# Altium schematic sheet CHM_CPU_FPGA_Main.SchDoc: CHOMIK CTRL module
size A3; Author: Andrzej Cichocki; Organization: Space Research Centre; Address1: Bartycka 18a; Address2: 00-716 Warsaw; Address3: Poland; Revision: 1; ModuleName: FPGA IP-Core Main; SubOrganization1: FPGA Space Applications Lab.
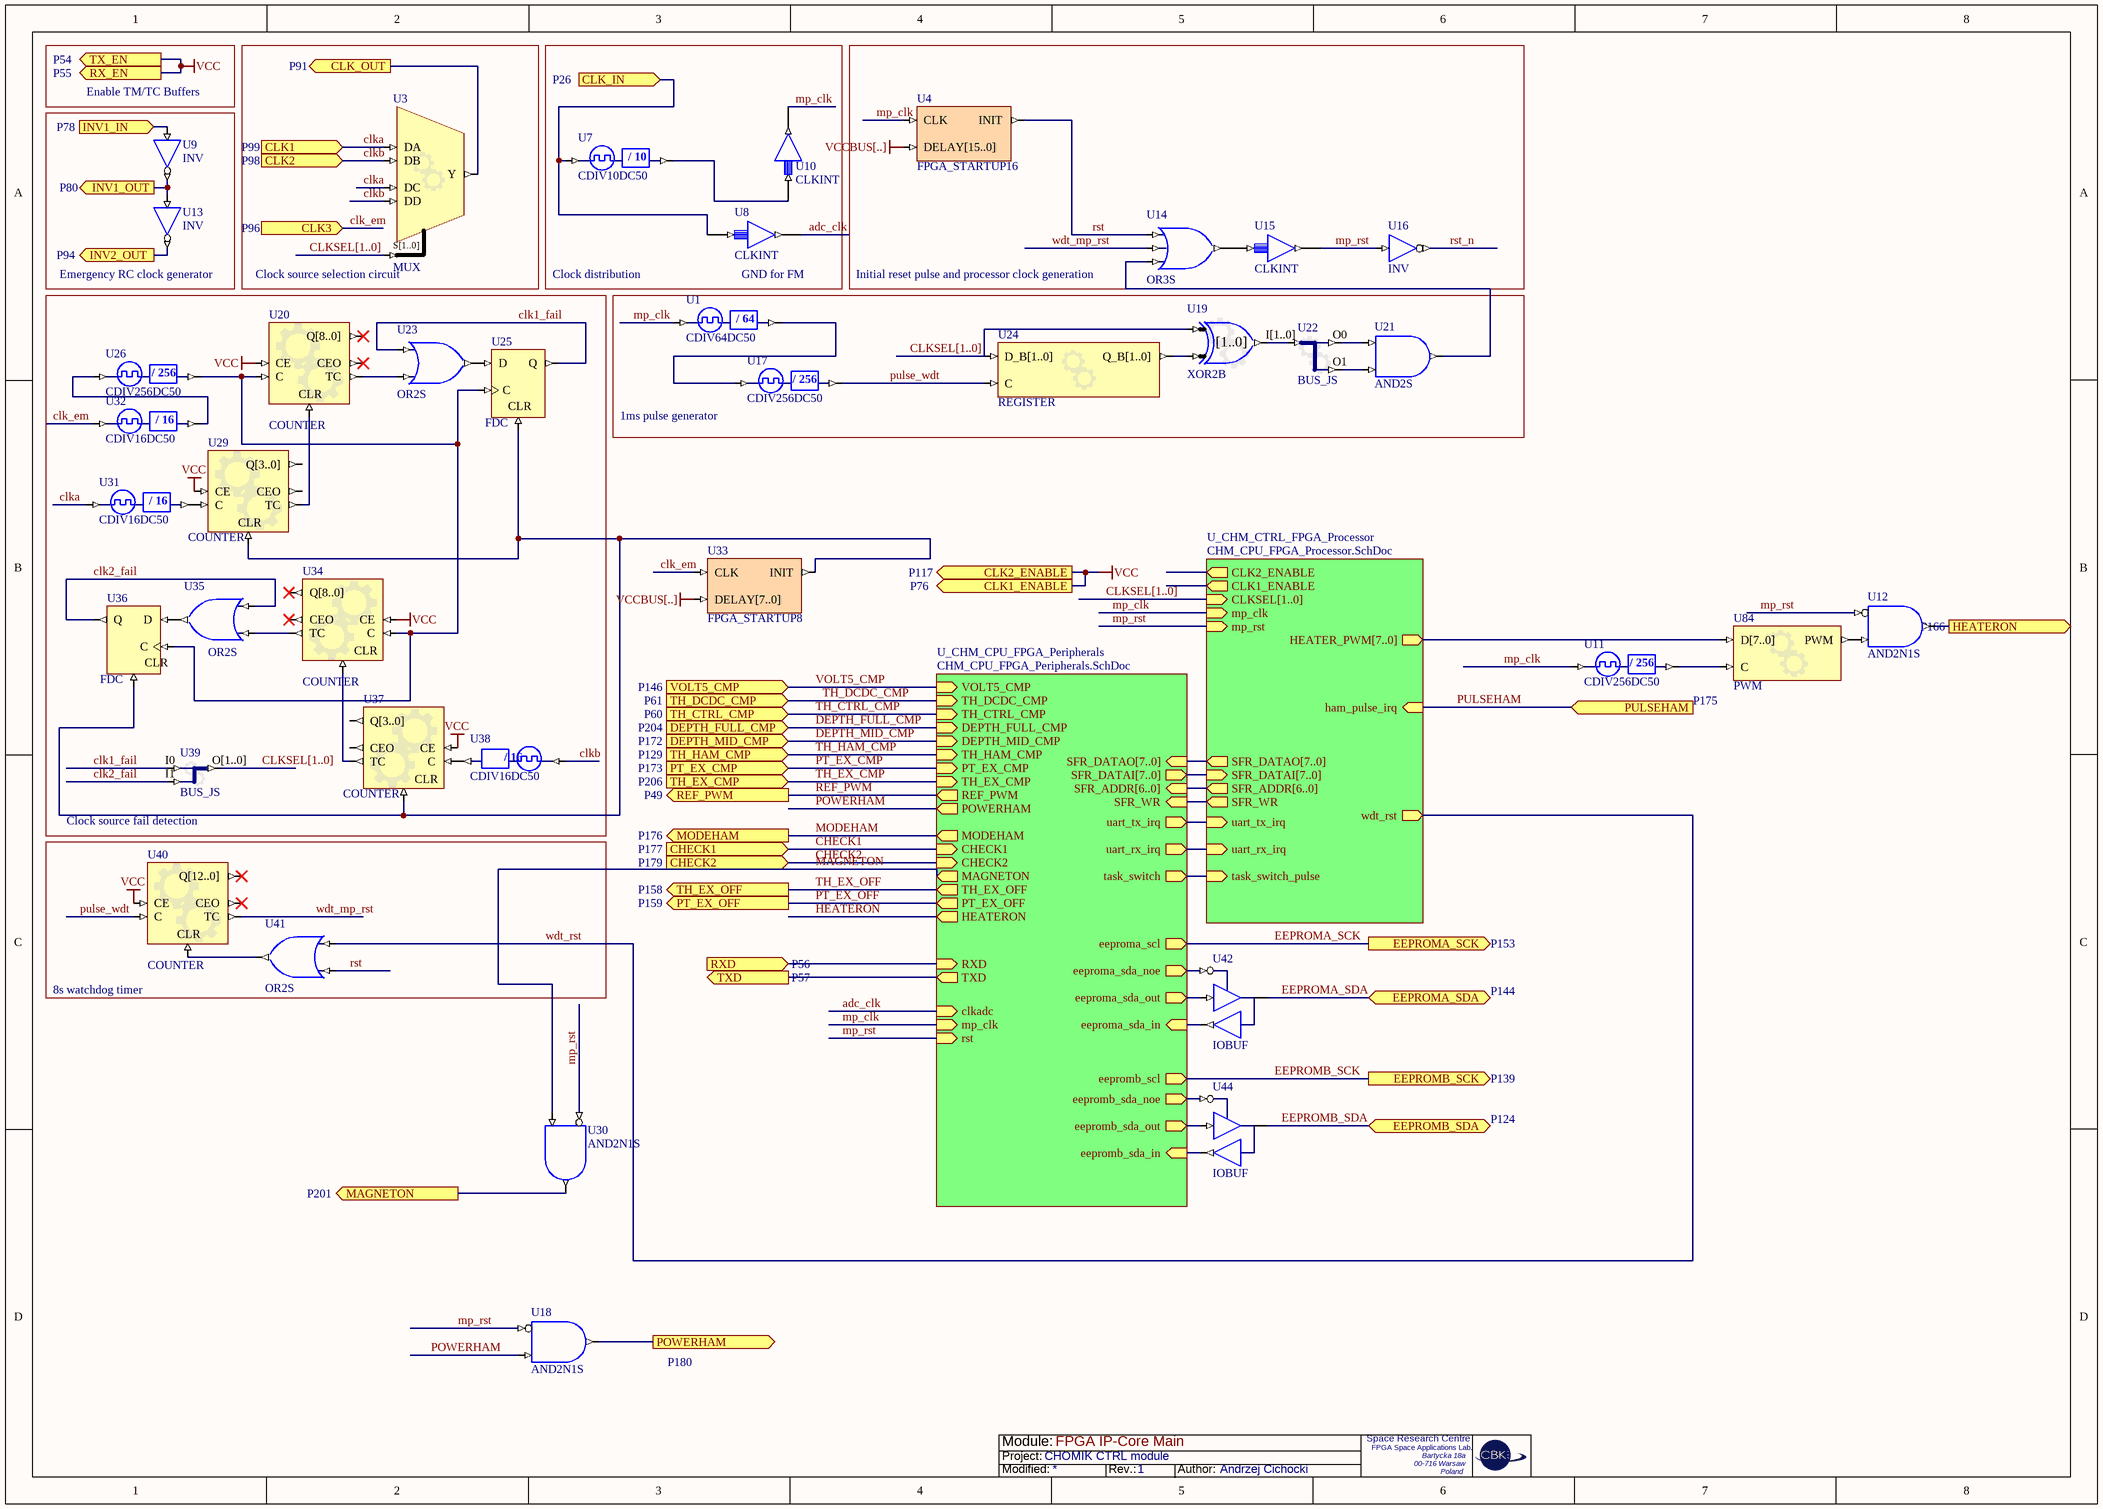
[diagram p0: CHM_CPU_FPGA_Main.SchDoc]

## Parts
U1  CDIV64DC50
U3  MUX
U4  FPGA_STARTUP16
U7  CDIV10DC50
U8  CLKINT
U9  INV
U10  CLKINT
U11  CDIV256DC50
U12  AND2N1S
U13  INV
U14  OR3S
U15  CLKINT
U16  INV
U17  CDIV256DC50
U18  AND2N1S
U19  XOR2B
U20  COUNTER
U21  AND2S
U22  BUS_JS
U23  OR2S
U24  REGISTER
U25  FDC
U26  CDIV256DC50
U29  COUNTER
U30  AND2N1S
U31  CDIV16DC50
U32  CDIV16DC50
U33  FPGA_STARTUP8
U34  COUNTER
U35  OR2S
U36  FDC
U37  COUNTER
U38  CDIV16DC50
U39  BUS_JS
U40  COUNTER
U41  OR2S
U42  IOBUF
U44  IOBUF
U84  PWM

## Blocks framed on the sheet
Clock source selection circuit: U3
Initial reset pulse and processor clock generation: U4 U14-U16

## Sub-sheets
U_CHM_CPU_FPGA_Peripherals = CHM_CPU_FPGA_Peripherals.SchDoc: VOLT5_CMP (in), TH_DCDC_CMP (in), TH_CTRL_CMP (in), DEPTH_FULL_CMP (in), DEPTH_MID_CMP (in), TH_HAM_CMP (in), PT_EX_CMP (in), TH_EX_CMP (in), REF_PWM (out), POWERHAM (out), MODEHAM (out), CHECK1 (in), CHECK2 (in), MAGNETON (out), TH_EX_OFF (out), PT_EX_OFF (out), HEATERON (out), TXD (out), RXD (in), rst (in), mp_clk (in), clkadc (in), uart_rx_irq (out), eeproma_scl (out), eeproma_sda_noe (out), eeproma_sda_out (out), eeproma_sda_in (in), eepromb_scl (out), eepromb_sda_noe (out), eepromb_sda_out (out), eepromb_sda_in (in), task_switch (out), uart_tx_irq (out), SFR_DATAO[7..0] (in), SFR_DATAI[7..0] (out), SFR_ADDR[6..0] (in), SFR_WR (in)
U_CHM_CTRL_FPGA_Processor = CHM_CPU_FPGA_Processor.SchDoc: mp_clk (in), ham_pulse_irq (in), uart_rx_irq (in), CLK2_ENABLE (out), CLK1_ENABLE (out), CLKSEL[1..0] (in), wdt_rst (out), task_switch_pulse (in), uart_tx_irq (in), SFR_DATAO[7..0] (out), SFR_DATAI[7..0] (in), SFR_ADDR[6..0] (out), SFR_WR (out), mp_rst (in), HEATER_PWM[7..0] (out)

## Ports
CHECK1 (in, see P177), CHECK2 (in, see P179), CLK1 (in, see P99), CLK1_ENABLE (out, see P76), CLK2 (in, see P98), CLK2_ENABLE (out, see P117), CLK3 (in, see P96), CLK_IN (in, see P26), CLK_OUT (out, see P91), DEPTH_FULL_CMP (in, see P204), DEPTH_MID_CMP (in, see P172), EEPROMA_SCK (out, see P153), EEPROMA_SDA (bidir, see P144), EEPROMB_SCK (out, see P139), EEPROMB_SDA (bidir, see P124), HEATERON (out, see P166), INV1_IN (in, see P78), INV1_OUT (out, see P80), INV2_OUT (out, see P94), MAGNETON (out, see P201), MODEHAM (out, see P176), POWERHAM (out, see P180), PT_EX_CMP (in, see P173), PT_EX_OFF (out, see P159), PULSEHAM (in, see P175), REF_PWM (out, see P49), RX_EN (out, see P55), RXD (in, see P56), TH_CTRL_CMP (in, see P60), TH_DCDC_CMP (in, see P61), TH_EX_CMP (in, see P206), TH_EX_OFF (out, see P158), TH_HAM_CMP (in, see P129), TX_EN (out, see P54), TXD (out, see P57), VOLT5_CMP (in, see P146)

## Nets
VCC: U20.CE U29.CE U34.CE U37.CE U40.CE ; port CLK2_ENABLE, port CLK1_ENABLE, port TX_EN, port RX_EN
VCCBUS[..]: U4.DELAY[15..0] U33.DELAY[7..0]
adc_clk: U8.Y ; sheet U_CHM_CPU_FPGA_Peripherals/clkadc
CHECK1: port CHECK1, sheet U_CHM_CPU_FPGA_Peripherals/CHECK1
CHECK2: port CHECK2, sheet U_CHM_CPU_FPGA_Peripherals/CHECK2
clk1_fail: U23.I0 U25.Q U39.I0
clk2_fail: U35.I0 U36.Q U39.I1
clk_em: U32.CLKIN U33.CLK ; port CLK3
CLK_IN: U7.CLKIN U8.A ; port CLK_IN
CLK_OUT: U3.Y ; port CLK_OUT
clka: U3.DA U3.DC U31.CLKIN ; port CLK1
clkb: U3.DB U3.DD U38.CLKIN ; port CLK2
CLKSEL[1..0]: U3.S[1..0] U19.I0_B[1..0] U24.D_B[1..0] U39.O[1..0] ; sheet U_CHM_CTRL_FPGA_Processor/CLKSEL[1..0]
DEPTH_FULL_CMP: port DEPTH_FULL_CMP, sheet U_CHM_CPU_FPGA_Peripherals/DEPTH_FULL_CMP
DEPTH_MID_CMP: port DEPTH_MID_CMP, sheet U_CHM_CPU_FPGA_Peripherals/DEPTH_MID_CMP
EEPROMA_SCK: port EEPROMA_SCK, sheet U_CHM_CPU_FPGA_Peripherals/eeproma_scl
EEPROMA_SDA: U42.IO ; port EEPROMA_SDA
EEPROMB_SCK: port EEPROMB_SCK, sheet U_CHM_CPU_FPGA_Peripherals/eepromb_scl
EEPROMB_SDA: U44.IO ; port EEPROMB_SDA
HEATERON: U12.O ; port HEATERON
HEATERON: sheet U_CHM_CPU_FPGA_Peripherals/HEATERON  [a separate net that carries the same name]
INV1_IN: U9.I ; port INV1_IN
INV1_OUT: U9.O U13.I ; port INV1_OUT
INV2_OUT: U13.O ; port INV2_OUT
MAGNETON: U30.O ; port MAGNETON
MAGNETON: U30.I1 ; sheet U_CHM_CPU_FPGA_Peripherals/MAGNETON  [a separate net that carries the same name]
MODEHAM: port MODEHAM, sheet U_CHM_CPU_FPGA_Peripherals/MODEHAM
mp_clk: U1.CLKIN U4.CLK U10.Y U11.CLKIN ; sheet U_CHM_CTRL_FPGA_Processor/mp_clk, sheet U_CHM_CPU_FPGA_Peripherals/mp_clk
mp_rst: U12.I0 U15.Y U16.I U18.I0 U30.I0 ; sheet U_CHM_CTRL_FPGA_Processor/mp_rst, sheet U_CHM_CPU_FPGA_Peripherals/rst
POWERHAM: U18.O ; port POWERHAM
POWERHAM: U18.I1 ; sheet U_CHM_CPU_FPGA_Peripherals/POWERHAM  [a separate net that carries the same name]
PT_EX_CMP: port PT_EX_CMP, sheet U_CHM_CPU_FPGA_Peripherals/PT_EX_CMP
PT_EX_OFF: port PT_EX_OFF, sheet U_CHM_CPU_FPGA_Peripherals/PT_EX_OFF
pulse_wdt: U17.CLKDV U24.C U40.C
PULSEHAM: port PULSEHAM, sheet U_CHM_CTRL_FPGA_Processor/ham_pulse_irq
REF_PWM: port REF_PWM, sheet U_CHM_CPU_FPGA_Peripherals/REF_PWM
rst: U4.INIT U14.I0 U41.I1
rst_n: U16.O
RXD: port RXD, sheet U_CHM_CPU_FPGA_Peripherals/RXD
TH_CTRL_CMP: port TH_CTRL_CMP, sheet U_CHM_CPU_FPGA_Peripherals/TH_CTRL_CMP
TH_DCDC_CMP: port TH_DCDC_CMP, sheet U_CHM_CPU_FPGA_Peripherals/TH_DCDC_CMP
TH_EX_CMP: port TH_EX_CMP, sheet U_CHM_CPU_FPGA_Peripherals/TH_EX_CMP
TH_EX_OFF: port TH_EX_OFF, sheet U_CHM_CPU_FPGA_Peripherals/TH_EX_OFF
TH_HAM_CMP: port TH_HAM_CMP, sheet U_CHM_CPU_FPGA_Peripherals/TH_HAM_CMP
TXD: port TXD, sheet U_CHM_CPU_FPGA_Peripherals/TXD
VOLT5_CMP: port VOLT5_CMP, sheet U_CHM_CPU_FPGA_Peripherals/VOLT5_CMP
wdt_mp_rst: U14.I1 U40.TC
wdt_rst: U41.I0 ; sheet U_CHM_CTRL_FPGA_Processor/wdt_rst
NetU1_CLKDV: U1.CLKDV U17.CLKIN
NetU7_CLKDV: U7.CLKDV U10.A
NetU11_CLKDV: U11.CLKDV U84.C
NetU12_I1: U12.I1 U84.PWM
NetU14_I2: U14.I2 U21.O
NetU14_O: U14.O U15.A
NetU19_I1_B[1..0]: U19.I1_B[1..0] U24.Q_B[1..0]
NetU19_O[1..0]: U19.O[1..0] U22.I[1..0]
NetU20_C: U20.C U25.C U26.CLKDV U34.C U36.C
NetU20_CLR: U20.CLR U29.TC
NetU20_TC: U20.TC U23.I1
NetU21_I0: U21.I0 U22.O0
NetU21_I1: U21.I1 U22.O1
NetU23_O: U23.O U25.D
NetU25_CLR: U25.CLR U29.CLR U33.INIT U36.CLR U37.CLR
NetU26_CLKIN: U26.CLKIN U32.CLKDV
NetU29_C: U29.C U31.CLKDV
NetU34_CLR: U34.CLR U37.TC
NetU34_TC: U34.TC U35.I1
NetU35_O: U35.O U36.D
NetU37_C: U37.C U38.CLKDV
NetU40_CLR: U40.CLR U41.O
NetU42_I: U42.I ; sheet U_CHM_CPU_FPGA_Peripherals/eeproma_sda_out
NetU42_O: U42.O ; sheet U_CHM_CPU_FPGA_Peripherals/eeproma_sda_in
NetU42_T: U42.T ; sheet U_CHM_CPU_FPGA_Peripherals/eeproma_sda_noe
NetU44_I: U44.I ; sheet U_CHM_CPU_FPGA_Peripherals/eepromb_sda_out
NetU44_O: U44.O ; sheet U_CHM_CPU_FPGA_Peripherals/eepromb_sda_in
NetU44_T: U44.T ; sheet U_CHM_CPU_FPGA_Peripherals/eepromb_sda_noe
NetU84_D[7..0]: U84.D[7..0] ; sheet U_CHM_CTRL_FPGA_Processor/HEATER_PWM[7..0]
(unnamed): sheet U_CHM_CTRL_FPGA_Processor/uart_rx_irq, sheet U_CHM_CPU_FPGA_Peripherals/uart_rx_irq
(unnamed): sheet U_CHM_CTRL_FPGA_Processor/task_switch_pulse, sheet U_CHM_CPU_FPGA_Peripherals/task_switch
(unnamed): sheet U_CHM_CTRL_FPGA_Processor/uart_tx_irq, sheet U_CHM_CPU_FPGA_Peripherals/uart_tx_irq
(unnamed): sheet U_CHM_CTRL_FPGA_Processor/SFR_WR, sheet U_CHM_CPU_FPGA_Peripherals/SFR_WR

Not connected (* = marked no-connect by the designer): U20 CEO* Q[8..0]*; U29 CEO Q[3..0]; U34 CEO* Q[8..0]*; U37 CEO Q[3..0]; U40 CEO* Q[12..0]*

## Buses and harness runs
bus CLKSEL[1..0]
bus CLKSEL[1..0] = sheet U_CHM_CTRL_FPGA_Processor/CLKSEL[1..0]
bus sheet U_CHM_CPU_FPGA_Peripherals/SFR_ADDR[6..0] = sheet U_CHM_CTRL_FPGA_Processor/SFR_ADDR[6..0]
bus sheet U_CHM_CPU_FPGA_Peripherals/SFR_DATAI[7..0] = sheet U_CHM_CTRL_FPGA_Processor/SFR_DATAI[7..0]
bus sheet U_CHM_CPU_FPGA_Peripherals/SFR_DATAO[7..0] = sheet U_CHM_CTRL_FPGA_Processor/SFR_DATAO[7..0]

## Notes on the sheet
- (near U9) Enable TM/TC Buffers
- (near U13) Emergency RC clock generator
- (near U1) Clock distribution
- GND for FM
- (near U17) 1ms pulse generator
- Clock source fail detection
- (near U40) 8s watchdog timer
- Module:
- Project:
- Modified:
- Rev.:
- Author:
- (in symbol CDIV10DC50) / 10
- (in symbol CDIV16DC50) / 16
- (in symbol CDIV64DC50) / 64
- (in symbol CDIV256DC50) / 256
- (in symbol GATE) [1..0]

## Library data of the parts
U1 = CDIV64DC50: Clock Divider by 64 with 50% Duty Cycle Output; DivisorRate: 64; DutyCycle: 50; ArchiveName: GENERIC; VHDLIB_SIM: GENERIC_LIB; Published: 29-Jan-2004; Publisher: Altium Limited; LastRevisionNo: 1.00.00; HelpURL: CR0118 FPGA Generic Library Guide.pdf#page=143; ComponentLink1URL: CR0127 FPGA Clock Divider Resource Usage.pdf#page=27; ComponentLink1Description: Core &Resource Usage; FunctionalClass: Clock Divider
U3 = MUX: Configurable Mutliplexer; ConfigurationParameters: {}Version[1.0]{}ShowEnable[False]{}BusInputs[False]{}BusOutputs[False]{}SignalWidth[1]{}Type[Multiplexer]{}RegisterOutputs[False]{}NegativeClockEdge[False]{}ShowPinNames[True]{}InvertSingleSignal[False]{}SignalCount[4]{}Invert0[False]{}Invert1[False]{}Invert2[False]{}Invert3[False]{}; ConfiguratorName: GENERIC_MULTIPLEXER; LastRevisionNo: 1.00.00; Published: 31-Dec-2008; Publisher: Altium Limited
U4 = FPGA_STARTUP16: FPGA Startup With 16 Bit Delay; Published: 9-Dec-2004; Publisher: Altium Limited; HelpURL: CR0119 FPGA_STARTUPx Powerup Delay Unit.pdf; LastRevisionNo: 1.00.00; ComponentLink1Description: Core &Resource Usage; ComponentLink1URL: CR0139 FPGA Peripheral Resource Usage.pdf#page=13
U7 = CDIV10DC50: Clock Divider by 10 with 50% Duty Cycle Output; XilinxEquivalent: CLK_DIV10; DivisorRate: 10; DutyCycle: 50; ArchiveName: GENERIC; VHDLIB_SIM: GENERIC_LIB; Published: 29-Jan-2004; Publisher: Altium Limited; LastRevisionNo: 1.00.00; HelpURL: CR0118 FPGA Generic Library Guide.pdf#page=143; ComponentLink1URL: CR0127 FPGA Clock Divider Resource Usage.pdf#page=15; ComponentLink1Description: Core &Resource Usage; FunctionalClass: Clock Divider
U8 U10 U15 = CLKINT: 2.5 Volt CMOS input levels, low drive strength, low slew rate; FPGAVendor: Actel; Published: 25-Oct-2005; Publisher: Altium Limited; HelpURL: http://www.actel.com/documents/pa3_libguide.pdf
U9 U13 U16 = INV: Inverter; FunctionalClass: Logic Primitive; ArchiveName: GENERIC; VHDLIB_SIM: GENERIC_LIB; Published: 29-Jan-2004; Publisher: Altium Limited; XilinxEquivalent: INV; LastRevisionNo: 1.00.00; HelpURL: CR0118 FPGA Generic Library Guide.pdf#page=291; ComponentLink1URL: CR0136 FPGA Logic Primitive Resource Usage.pdf#page=61; ComponentLink1Description: Core &Resource Usage; SubClass: INV
U11 U17 U26 = CDIV256DC50: Clock Divider by 256 with 50% Duty Cycle Output; DivisorRate: 256; DutyCycle: 50; ArchiveName: GENERIC; VHDLIB_SIM: GENERIC_LIB; Published: 29-Jan-2004; Publisher: Altium Limited; LastRevisionNo: 1.00.00; HelpURL: CR0118 FPGA Generic Library Guide.pdf#page=143; ComponentLink1URL: CR0127 FPGA Clock Divider Resource Usage.pdf#page=31; ComponentLink1Description: Core &Resource Usage; FunctionalClass: Clock Divider
U12 U18 U30 = AND2N1S: 2-Input AND Gate with Active Low A Input, Single Pin Version; XilinxEquivalent: AND2B1; FunctionalClass: Logic Primitive; PortSize: 2; ArchiveName: GENERIC; VHDLIB_SIM: GENERIC_LIB; Published: 29-Jan-2004; Publisher: Altium Limited; LastRevisionNo: 1.00.00; HelpURL: CR0118 FPGA Generic Library Guide.pdf#page=114; ComponentLink1URL: CR0136 FPGA Logic Primitive Resource Usage.pdf#page=10; ComponentLink1Description: Core &Resource Usage; SubClass: AND; PortStyle: Single Pin Version
U14 = OR3S: 3-Input OR Gate, Single Pin Version; XilinxEquivalent: OR3; FunctionalClass: Logic Primitive; PortSize: 3; ArchiveName: GENERIC; VHDLIB_SIM: GENERIC_LIB; Published: 29-Jan-2004; Publisher: Altium Limited; LastRevisionNo: 1.00.00; HelpURL: CR0118 FPGA Generic Library Guide.pdf#page=410; ComponentLink1URL: CR0136 FPGA Logic Primitive Resource Usage.pdf#page=200; ComponentLink1Description: Core &Resource Usage; SubClass: OR; PortStyle: Single Pin Version
U19 = GATE: Configurable Generic Gate; ConfiguratorName: GENERIC_GATE; ConfigurationParameters: {}Version[1.1]{}GateKind[XOR]{}BusInput[False]{}GateInputType[Bus]{}GateOutputOption[Normal]{}BusWidth[2]{}RegisterOutputs[False]{}NegativeClockEdge[False]{}InputCount[2]{}InputInvert0[False]{}InputInvert1[False]{}; LastRevisionNo: 1.00.00; Published: 3-Sep-2008; Publisher: Altium Limited; HelpURL: https://wiki.altium.com/display/ADOH/Configurable+Generic+Library
U20 U34 = COUNTER: Configurable Counter; ConfiguratorName: GENERIC_COUNTER; ConfigurationParameters: {}Version[1.0]{}Type[Binary]{}SyncReset[False]{}NegativeClockEdge[False]{}FixedDirection[True]{}IsIncrement[True]{}SignalWidth[9]{}MaxValue[511]{}BusOutput[True]{}Loadable[False]{}BusInput[False]{}; LastRevisionNo: 1.00.00; Published: 14-Jan-2009; Publisher: Altium Limited
U21 = AND2S: 2-Input AND Gate, Single Pin Version; XilinxEquivalent: AND2; FunctionalClass: Logic Primitive; PortSize: 2; ArchiveName: GENERIC; VHDLIB_SIM: GENERIC_LIB; Published: 29-Jan-2004; Publisher: Altium Limited; LastRevisionNo: 1.00.00; HelpURL: CR0118 FPGA Generic Library Guide.pdf#page=114; ComponentLink1URL: CR0136 FPGA Logic Primitive Resource Usage.pdf#page=13; ComponentLink1Description: Core &Resource Usage; SubClass: AND; PortStyle: Single Pin Version
U22 = BUS_JS: Configurable Bus Joiner/Splitter; ConfiguratorName: GENERIC_BUS_JS; ConfigurationParameters: {}Version[1.1]{}SplitterJoinerType[Splitter]{}SignalCount[2]{}SignalWidth0[1]{}GapBelow0[2000000]{}ConnectionType0[Pin]{}SignalWidth1[1]{}GapBelow1[1000000]{}ConnectionType1[Pin]{}ShowPinNames[True]{}; LastRevisionNo: 1.00.00; Published: 17-Sep-2008; Publisher: Altium Limited; HelpURL: https://wiki.altium.com/display/ADOH/Configurable+Generic+Library
U23 U35 U41 = OR2S: 2-Input OR Gate, Single Pin Version; XilinxEquivalent: OR2; FunctionalClass: Logic Primitive; PortSize: 2; ArchiveName: GENERIC; VHDLIB_SIM: GENERIC_LIB; Published: 29-Jan-2004; Publisher: Altium Limited; LastRevisionNo: 1.00.00; HelpURL: CR0118 FPGA Generic Library Guide.pdf#page=410; ComponentLink1URL: CR0136 FPGA Logic Primitive Resource Usage.pdf#page=190; ComponentLink1Description: Core &Resource Usage; SubClass: OR; PortStyle: Single Pin Version
U24 = REGISTER: Configurable Register; ConfiguratorName: GENERIC_REGISTER; ConfigurationParameters: {}Version[1.1]{}RegisterType[DFlipFlop]{}NegativeTrigger[False]{}TriggerEnable[False]{}ResetMode[None]{}SetMode[None]{}SignalCount[1]{}SignalWidth0[2]{}OutputOption0[Normal]{}; LastRevisionNo: 1.00.00; Published: 13-Oct-2008; Publisher: Altium Limited; HelpURL: https://wiki.altium.com/display/ADOH/Configurable+Generic+Library
U25 U36 = FDC: D-Type Flip-Flop with Asynchronous Clear; SubClass: FD; ClockTrigger: Rising; ArchiveName: GENERIC; VHDLIB_SIM: GENERIC_LIB; Published: 29-Jan-2004; Publisher: Altium Limited; XilinxEquivalent: FDC; LastRevisionNo: 1.00.00; HelpURL: CR0118 FPGA Generic Library Guide.pdf#page=172; ComponentLink1URL: CR0133 FPGA Flip Flop Resource Usage.pdf#page=150; ComponentLink1Description: Core &Resource Usage; FunctionalClass: Flip-Flop; Reset: Asynchronous
U29 U37 = COUNTER: Configurable Counter; ConfiguratorName: GENERIC_COUNTER; ConfigurationParameters: {}Version[1.0]{}Type[Binary]{}SyncReset[False]{}NegativeClockEdge[False]{}FixedDirection[True]{}IsIncrement[True]{}SignalWidth[4]{}MaxValue[15]{}BusOutput[True]{}Loadable[False]{}BusInput[False]{}; LastRevisionNo: 1.00.00; Published: 14-Jan-2009; Publisher: Altium Limited
U31 U32 U38 = CDIV16DC50: Clock Divider by 16 with 50% Duty Cycle Output; XilinxEquivalent: CLK_DIV16; DivisorRate: 16; DutyCycle: 50; ArchiveName: GENERIC; VHDLIB_SIM: GENERIC_LIB; Published: 29-Jan-2004; Publisher: Altium Limited; LastRevisionNo: 1.00.00; HelpURL: CR0118 FPGA Generic Library Guide.pdf#page=143; ComponentLink1URL: CR0127 FPGA Clock Divider Resource Usage.pdf#page=19; ComponentLink1Description: Core &Resource Usage; FunctionalClass: Clock Divider
U33 = FPGA_STARTUP8: FPGA Startup With 8 Bit Delay; Published: 9-Dec-2004; Publisher: Altium Limited; HelpURL: CR0119 FPGA_STARTUPx Powerup Delay Unit.pdf; LastRevisionNo: 1.00.00; ComponentLink1Description: Core &Resource Usage; ComponentLink1URL: CR0139 FPGA Peripheral Resource Usage.pdf#page=11
U39 = BUS_JS: Configurable Bus Joiner/Splitter; ConfiguratorName: GENERIC_BUS_JS; ConfigurationParameters: {}Version[1.1]{}SplitterJoinerType[Joiner]{}SignalCount[2]{}SignalWidth0[1]{}GapBelow0[1000000]{}ConnectionType0[Pin]{}SignalWidth1[1]{}GapBelow1[1000000]{}ConnectionType1[Pin]{}ShowPinNames[True]{}; LastRevisionNo: 1.00.00; Published: 17-Sep-2008; Publisher: Altium Limited; HelpURL: https://wiki.altium.com/display/ADOH/Configurable+Generic+Library
U40 = COUNTER: Configurable Counter; ConfiguratorName: GENERIC_COUNTER; ConfigurationParameters: {}Version[1.0]{}Type[Binary]{}SyncReset[False]{}NegativeClockEdge[False]{}FixedDirection[True]{}IsIncrement[True]{}SignalWidth[13]{}MaxValue[8191]{}BusOutput[True]{}Loadable[False]{}BusInput[False]{}; LastRevisionNo: 1.00.00; Published: 14-Jan-2009; Publisher: Altium Limited
U42 U44 = IOBUF: Input/Output Buffer; Enable: Low; Control: Common Control T; ArchiveName: GENERIC; VHDLIB_SIM: GENERIC_LIB; Published: 29-Jan-2004; Publisher: Altium Limited; XilinxEquivalent: IOBUF; LastRevisionNo: 1.00.00; HelpURL: CR0118 FPGA Generic Library Guide.pdf#page=293; ComponentLink1URL: CR0125 FPGA Buffer Resource Usage.pdf#page=78; ComponentLink1Description: Core &Resource Usage; FunctionalClass: Buffer; SubClass: IOBUF
U84 = PWM: Configurable PWM; ConfiguratorName: GENERIC_PWM; ConfigurationParameters: {}Version[1.0]{}Width[8]{}Prescaler[1]{}; LastRevisionNo: 1.00.00; Published: 8-Apr-2009; Publisher: Altium Limited; HelpURL: https://wiki.altium.com/display/ADOH/New+Configurable+Generic+FPGA+Logic+Components